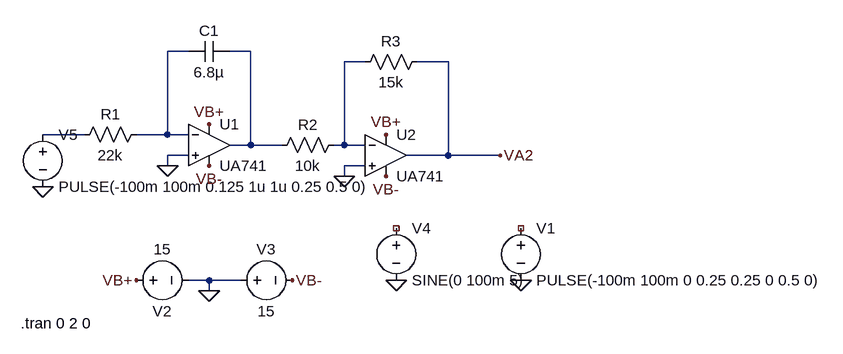
[diagram p0: schematic Draft3.asc]
Draft3.asc, the LTspice schematic file:
Version 4
SHEET 1 1392 680
WIRE 416 16 384 16
WIRE 512 16 480 16
WIRE 688 32 656 32
WIRE 816 32 768 32
WIRE 256 144 192 144
WIRE 384 144 384 16
WIRE 384 144 336 144
WIRE 416 144 384 144
WIRE 512 160 512 16
WIRE 512 160 480 160
WIRE 560 160 512 160
WIRE 656 160 656 32
WIRE 656 160 640 160
WIRE 688 160 656 160
WIRE 416 176 384 176
WIRE 816 176 816 32
WIRE 816 176 752 176
WIRE 896 176 816 176
WIRE 384 192 384 176
WIRE 688 192 656 192
WIRE 656 208 656 192
WIRE 448 368 416 368
WIRE 496 368 448 368
WIRE 448 384 448 368
FLAG 384 192 0
FLAG 656 208 0
FLAG 896 176 VA2
FLAG 336 368 VB+
FLAG 448 128 VB+
FLAG 720 144 VB+
FLAG 928 368 0
FLAG 448 192 VB-
FLAG 576 368 VB-
FLAG 720 208 VB-
FLAG 448 384 0
FLAG 192 224 0
FLAG 736 368 0
SYMBOL voltage 928 272 R0
WINDOW 123 0 0 Left 0
WINDOW 39 0 0 Left 0
SYMATTR InstName V1
SYMATTR Value PULSE(-100m 100m 0 0.25 0.25 0 0.5 0)
SYMBOL res 352 128 R90
WINDOW 0 0 56 VBottom 2
WINDOW 3 32 56 VTop 2
SYMATTR InstName R1
SYMATTR Value 22k
SYMBOL UA741\\UA741 448 160 R0
SYMATTR InstName U1
SYMBOL UA741\\UA741 720 176 R0
SYMATTR InstName U2
SYMBOL res 656 144 R90
WINDOW 0 0 56 VBottom 2
WINDOW 3 32 56 VTop 2
SYMATTR InstName R2
SYMATTR Value 10k
SYMBOL cap 480 0 R90
WINDOW 0 0 32 VBottom 2
WINDOW 3 32 32 VTop 2
SYMATTR InstName C1
SYMATTR Value 6.8µ
SYMATTR SpiceLine ic=0
SYMBOL res 784 16 R90
WINDOW 0 0 56 VBottom 2
WINDOW 3 32 56 VTop 2
SYMATTR InstName R3
SYMATTR Value 15k
SYMBOL voltage 320 368 R270
WINDOW 0 -32 56 VBottom 2
WINDOW 3 32 56 VTop 2
WINDOW 123 0 0 Left 0
WINDOW 39 0 0 Left 0
SYMATTR InstName V2
SYMATTR Value 15
SYMBOL voltage 480 368 R270
WINDOW 0 32 56 VTop 2
WINDOW 3 -32 56 VBottom 2
WINDOW 123 0 0 Left 0
WINDOW 39 0 0 Left 0
SYMATTR InstName V3
SYMATTR Value 15
SYMBOL voltage 192 128 R0
WINDOW 123 0 0 Left 0
WINDOW 39 0 0 Left 0
SYMATTR InstName V5
SYMATTR Value PULSE(-100m 100m 0.125 1u 1u 0.25 0.5 0)
SYMBOL voltage 736 272 R0
WINDOW 123 0 0 Left 0
WINDOW 39 0 0 Left 0
SYMATTR InstName V4
SYMATTR Value SINE(0 100m 5)
TEXT 158 434 Left 2 !.tran 0 2 0

The netlist it stands for:
* Draft3.asc
V1 NC_01 0 PULSE(-100m 100m 0 0.25 0.25 0 0.5 0)
R1 N001 N004 22k
* U1: UA741 (symbol UA741\UA741 not available, pins judged from their places): In+=0 In-=N001 V+=VB+ V-=VB- OUT=N002
* U2: UA741 (symbol UA741\UA741 not available, pins judged from their places): In+=0 In-=N003 V+=VB+ V-=VB- OUT=VA2
R2 N003 N002 10k
C1 N002 N001 6.8µ ic=0
R3 VA2 N003 15k
V2 VB+ 0 15
V3 0 VB- 15
V5 N004 0 PULSE(-100m 100m 0.125 1u 1u 0.25 0.5 0)
V4 NC_02 0 SINE(0 100m 5)
.tran 0 2 0
.backanno
.end